# EAGLE schematic comunicacion_serial (EAGLE 9.6.2)
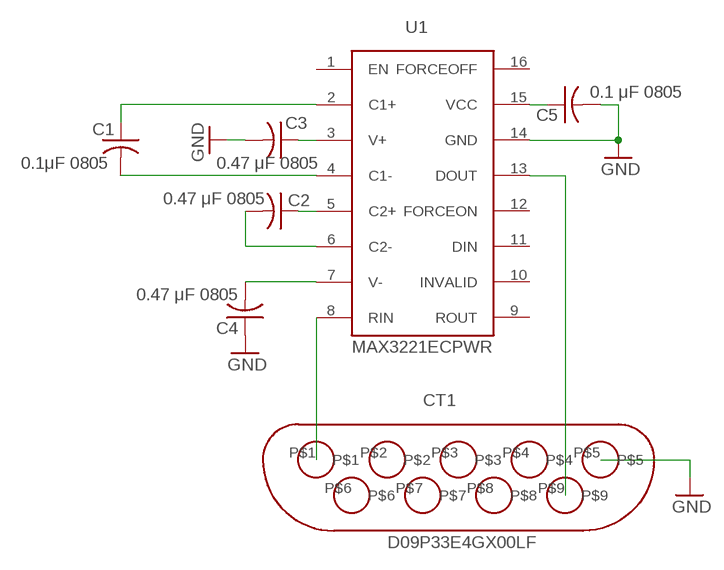
[diagram p0: schematic, sheet 1]

## Parts
C1  0.1μF 0805  C-USC0805  [C0805]
C2  0.47 μF 0805  C-USC0805  [C0805]
C3  0.47 μF 0805  C-USC0805  [C0805]
C4  0.47 μF 0805  C-USC0805  [C0805]
C5  0.1 μF 0805  C-USC0805  [C0805]
CT1  D09P33E4GX00LF  [JEDEC]
U1  MAX3221ECPWR  [TSSOP]

## Nets
GND: C3.2 C4.1 C5.2 CT1.P$5 U1.14(GND)
N$1: C1.1 U1.2(C1+)
N$2: C3.1 U1.3(V+)
N$3: C1.2 U1.4(C1-)
N$4: C2.1 U1.5(C2+)
N$5: C2.2 U1.6(C2-)
N$6: C4.2 U1.7(V-)
N$7: CT1.P$1 U1.8(RIN)
N$8: C5.1 U1.15(VCC)
N$9: CT1.P$9 U1.13(DOUT)
Unconnected: CT1.P$2 CT1.P$3 CT1.P$4 CT1.P$6 CT1.P$7 CT1.P$8 U1.1(EN) U1.9(ROUT) U1.10(INVALID) U1.11(DIN) U1.12(FORCEON) U1.16(FORCEOFF)

## Library data of the parts
C1 C5 = rcl:C-US: CAPACITOR, American symbol; PARTNO: GCM21BR72A104KA37L; SPICEPREFIX: C
C2-C4 = rcl:C-US: CAPACITOR, American symbol; PARTNO: GCM21BR71H474KA55L; SPICEPREFIX: C
CT1 = D09P33E4GX00LF_-_Amphenol_ICC_FCI_1:D09P33E4GX00LF; PART_NO: D09P33E4GX00LF
U1 = MAX3221ECPWR-TI:MAX3221ECPWR; PART_NO: MAX3221ECPWR